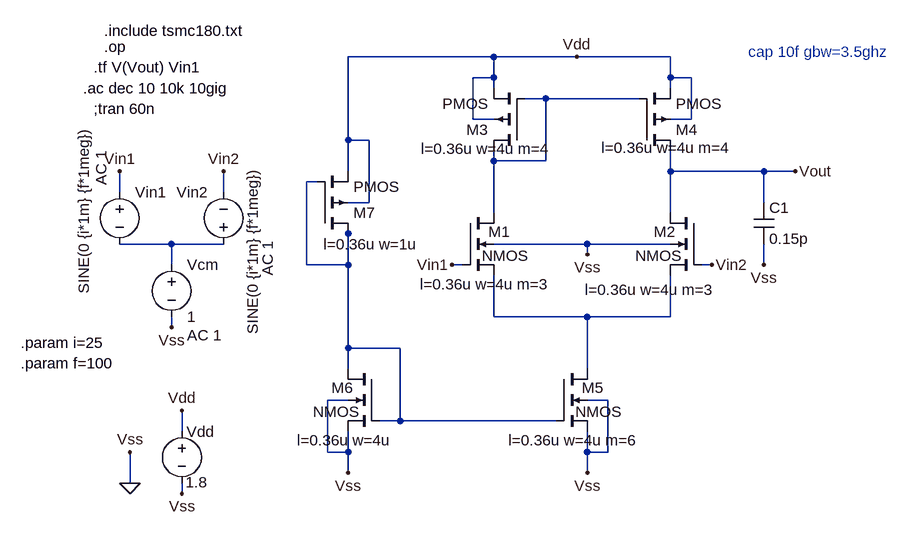
[diagram p0: schematic OP_AMP_55.asc]
OP_AMP_55.asc, the LTspice schematic file:
Version 4
SHEET 1 1612 740
WIRE 976 -16 752 -16
WIRE 1104 -16 976 -16
WIRE 1248 -16 1104 -16
WIRE 976 16 976 -16
WIRE 976 16 944 16
WIRE 1248 16 1248 -16
WIRE 1280 16 1248 16
WIRE 976 32 976 16
WIRE 1248 32 1248 16
WIRE 1056 48 1024 48
WIRE 1200 48 1056 48
WIRE 944 80 944 16
WIRE 976 80 944 80
WIRE 1280 80 1280 16
WIRE 1280 80 1248 80
WIRE 752 112 752 -16
WIRE 784 112 752 112
WIRE 976 144 976 128
WIRE 1056 144 1056 48
WIRE 1056 144 976 144
WIRE 752 160 752 112
WIRE 1248 160 1248 128
WIRE 1392 160 1248 160
WIRE 1440 160 1392 160
WIRE 704 176 688 176
WIRE 400 192 400 160
WIRE 560 192 560 160
WIRE 784 208 784 112
WIRE 784 208 752 208
WIRE 1392 208 1392 160
WIRE 976 224 976 144
WIRE 1248 224 1248 160
WIRE 752 256 752 240
WIRE 480 272 400 272
WIRE 560 272 480 272
WIRE 1120 272 976 272
WIRE 1248 272 1120 272
WIRE 1120 288 1120 272
WIRE 480 304 480 272
WIRE 688 304 688 176
WIRE 752 304 752 256
WIRE 752 304 688 304
WIRE 928 304 912 304
WIRE 1312 304 1296 304
WIRE 1392 304 1392 272
WIRE 976 384 976 320
WIRE 1120 384 976 384
WIRE 1248 384 1248 320
WIRE 1248 384 1120 384
WIRE 480 400 480 384
WIRE 752 432 752 304
WIRE 832 432 752 432
WIRE 752 464 752 432
WIRE 1120 464 1120 384
WIRE 752 512 720 512
WIRE 1152 512 1120 512
WIRE 832 544 832 432
WIRE 832 544 800 544
WIRE 1072 544 832 544
WIRE 496 560 496 528
WIRE 720 592 720 512
WIRE 752 592 752 560
WIRE 752 592 720 592
WIRE 1120 592 1120 560
WIRE 1152 592 1152 512
WIRE 1152 592 1120 592
WIRE 752 624 752 592
WIRE 1120 624 1120 592
WIRE 416 640 416 592
WIRE 496 656 496 640
FLAG 416 640 0
FLAG 416 592 Vss
FLAG 496 656 Vss
FLAG 480 400 Vss
FLAG 496 528 Vdd
FLAG 912 304 Vin1
FLAG 1104 -16 Vdd
FLAG 1312 304 Vin2
FLAG 1120 288 Vss
FLAG 400 160 Vin1
FLAG 560 160 Vin2
FLAG 1392 304 Vss
FLAG 1440 160 Vout
FLAG 1120 624 Vss
FLAG 752 624 Vss
SYMBOL nmos4 928 224 R0
WINDOW 0 40 29 Left 2
WINDOW 3 30 66 Left 2
WINDOW 123 135 110 Right 2
SYMATTR InstName M1
SYMATTR Value2 l=0.36u w=4u m=3
SYMBOL voltage 496 544 R0
WINDOW 123 0 0 Left 0
WINDOW 39 0 0 Left 0
WINDOW 0 7 17 Left 2
WINDOW 3 6 94 Left 2
SYMATTR InstName Vdd
SYMATTR Value 1.8
SYMBOL nmos4 1296 224 M0
WINDOW 0 40 29 Left 2
WINDOW 3 30 66 Left 2
WINDOW 123 -21 118 Left 2
SYMATTR InstName M2
SYMATTR Value2 l=0.36u w=4u m=3
SYMBOL voltage 480 288 R0
WINDOW 123 24 124 Left 2
WINDOW 39 0 0 Left 0
SYMATTR Value2 AC 1
SYMATTR InstName Vcm
SYMATTR Value 1
SYMBOL voltage 400 176 R0
WINDOW 3 -55 -84 VRight 2
WINDOW 123 -28 -48 VRight 2
WINDOW 39 0 0 Left 0
SYMATTR Value SINE(0 {i*1m} {f*1meg})
SYMATTR Value2 AC 1
SYMATTR InstName Vin1
SYMBOL voltage 560 288 R180
WINDOW 0 24 96 Left 2
WINDOW 3 -45 -123 VRight 2
WINDOW 123 -68 -33 VRight 2
WINDOW 39 0 0 Left 0
SYMATTR InstName Vin2
SYMATTR Value SINE(0 {i*1m} {f*1meg})
SYMATTR Value2 AC 1
SYMBOL pmos4 1024 128 R180
WINDOW 123 -40 3 Left 2
SYMATTR Value2 l=0.36u w=4u m=4
SYMATTR InstName M3
SYMBOL pmos4 1200 128 M180
WINDOW 123 -58 4 Left 2
SYMATTR Value2 l=0.36u w=4u m=4
SYMATTR InstName M4
SYMBOL cap 1376 208 R0
SYMATTR InstName C1
SYMATTR Value 0.15p
SYMBOL nmos4 1072 464 R0
WINDOW 0 40 29 Left 2
WINDOW 3 30 66 Left 2
WINDOW 123 127 110 Right 2
SYMATTR InstName M5
SYMATTR Value2 l=0.36u w=4u m=6
SYMBOL nmos4 800 464 M0
WINDOW 0 40 29 Left 2
WINDOW 3 30 66 Left 2
WINDOW 123 127 110 Right 2
SYMATTR InstName M6
SYMATTR Value2 l=0.36u w=4u
SYMBOL pmos4 704 256 M180
WINDOW 123 10 -16 Left 2
SYMATTR Value2 l=0.36u w=1u
SYMATTR InstName M7
TEXT 376 -56 Left 2 !.include tsmc180.txt
TEXT 376 -32 Left 2 !.op
TEXT 360 0 Left 2 !.tf V(Vout) Vin1
TEXT 344 32 Left 2 !.ac dec 10 10k 10gig
TEXT 360 64 Left 2 !;tran 60n
TEXT 248 424 Left 2 !.param i=25\n.param f=100
TEXT 1368 -24 Left 2 ;cap 10f gbw=3.5ghz

The netlist it stands for:
* OP_AMP_55.asc
M1 N001 Vin1 N004 0 NMOS l=0.36u w=4u m=3
Vdd Vdd 0 1.8
M2 Vout Vin2 N004 0 NMOS l=0.36u w=4u m=3
Vcm N003 0 1 AC 1
Vin1 Vin1 N003 SINE(0 {i*1m} {f*1meg}) AC 1
Vin2 N003 Vin2 SINE(0 {i*1m} {f*1meg}) AC 1
M3 N001 N001 Vdd Vdd PMOS l=0.36u w=4u m=4
M4 Vout N001 Vdd Vdd PMOS l=0.36u w=4u m=4
C1 Vout 0 0.15p
M5 N004 N002 0 0 NMOS l=0.36u w=4u m=6
M6 N002 N002 0 0 NMOS l=0.36u w=4u
M7 N002 N002 Vdd Vdd PMOS l=0.36u w=1u
.model NMOS NMOS
.model PMOS PMOS
.lib standard.mos
.include tsmc180.txt
.op
.tf V(Vout) Vin1
.ac dec 10 10k 10gig
;tran 60n
.param i=25
.param f=100
* cap 10f gbw=3.5ghz
.backanno
.end